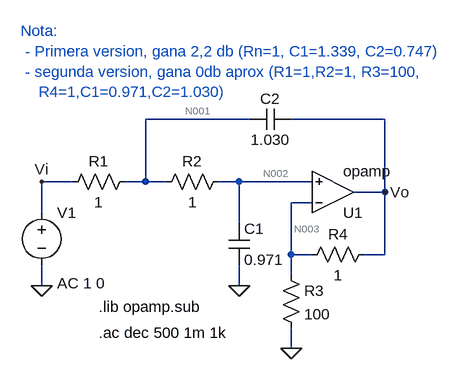
[diagram p0: schematic SOS1_sallenkey.asc]
SOS1_sallenkey.asc, the LTspice schematic file:
Version 4.1
SHEET 1 984 680
WIRE 256 -48 96 -48
WIRE 464 -48 320 -48
WIRE -16 48 -64 48
WIRE 96 48 96 -48
WIRE 96 48 64 48
WIRE 128 48 96 48
WIRE 240 48 208 48
WIRE 352 48 240 48
WIRE 464 64 464 -48
WIRE 464 64 416 64
WIRE 352 80 320 80
WIRE -64 96 -64 48
WIRE 240 112 240 48
WIRE 320 160 320 80
WIRE 352 160 320 160
WIRE 464 160 464 64
WIRE 464 160 432 160
WIRE 320 192 320 160
WIRE -64 208 -64 176
WIRE 240 208 240 176
WIRE 320 304 320 272
FLAG 320 304 0
FLAG 240 208 0
FLAG -64 208 0
FLAG 464 64 Vo
FLAG -64 48 Vi
SYMBOL voltage -64 80 R0
WINDOW 123 24 124 Left 2
WINDOW 39 0 0 Left 0
SYMATTR Value2 AC 1 0
SYMATTR InstName V1
SYMATTR Value ""
SYMBOL res 80 32 R90
WINDOW 0 0 56 VBottom 2
WINDOW 3 32 56 VTop 2
SYMATTR InstName R1
SYMATTR Value 1
SYMBOL res 224 32 R90
WINDOW 0 0 56 VBottom 2
WINDOW 3 32 56 VTop 2
SYMATTR InstName R2
SYMATTR Value 1
SYMBOL res 304 176 R0
SYMATTR InstName R3
SYMATTR Value 100
SYMBOL res 448 144 R90
WINDOW 0 0 56 VBottom 2
WINDOW 3 32 56 VTop 2
SYMATTR InstName R4
SYMATTR Value 1
SYMBOL OpAmps\\opamp 384 128 M180
SYMATTR InstName U1
SYMBOL cap 224 112 R0
SYMATTR InstName C1
SYMATTR Value 0.971
SYMBOL cap 320 -64 R90
WINDOW 0 0 32 VBottom 2
WINDOW 3 32 32 VTop 2
SYMATTR InstName C2
SYMATTR Value 1.030
TEXT 24 240 Left 2 !.lib opamp.sub
TEXT 24 280 Left 2 !.ac dec 500 1m 1k
TEXT -96 -184 Left 2 ;Nota:\n - Primera version, gana 2,2 db (Rn=1, C1=1.339, C2=0.747)\n - segunda version, gana 0db aprox (R1=1,R2=1, R3=100,\n    R4=1,C1=0.971,C2=1.030)

The netlist it stands for:
* SOS1_sallenkey.asc
V1 Vi 0 AC 1 0
R1 N001 Vi 1
R2 N002 N001 1
R3 N003 0 100
R4 Vo N003 1
X§U1 N003 N002 Vo opamp Aol=100K GBW=10Meg  ; pins invin noninvin out
C1 N002 0 0.971
C2 Vo N001 1.030
.lib opamp.sub
.ac dec 500 1m 1k
* Nota:
*  - Primera version, gana 2,2 db (Rn=1, C1=1.339, C2=0.747)
*  - segunda version, gana 0db aprox (R1=1,R2=1, R3=100,
*     R4=1,C1=0.971,C2=1.030)
.backanno
.end

* Results of the author's LTspice run, read from the files saved beside the schematic
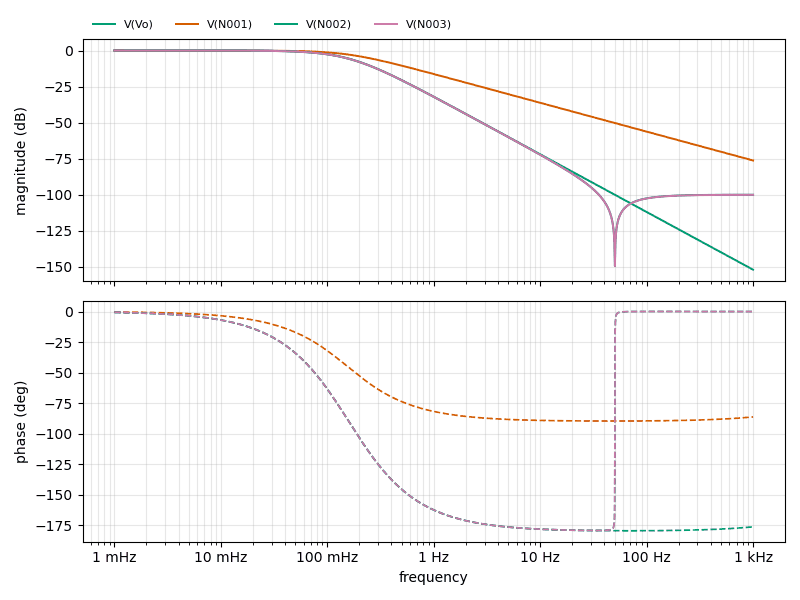
[diagram p1: AC Analysis of SOS1_sallenkey.asc, plotted from the saved traces]
* AC Analysis, 1 run:
*   V(Vo): 0.09 dB at 1 mHz, -99.94 dB at 1 kHz, peak 0.09 dB at 1 mHz, 3 dB below the peak at 107.6 mHz
*   V(N001): -0.00 dB at 1 mHz, -76.20 dB at 1 kHz, peak -0.00 dB at 1 mHz, 3 dB below the peak at 165.4 mHz
*   V(N002): -0.00 dB at 1 mHz, -151.91 dB at 1 kHz, peak -0.00 dB at 1 mHz, 3 dB below the peak at 107.6 mHz
*   V(N003): -0.00 dB at 1 mHz, -100.02 dB at 1 kHz, peak -0.00 dB at 1 mHz, 3 dB below the peak at 107.6 mHz